# Altium schematic sheet MCU.SchDoc
size A2; SheetNumber: 1; SheetTotal: 7
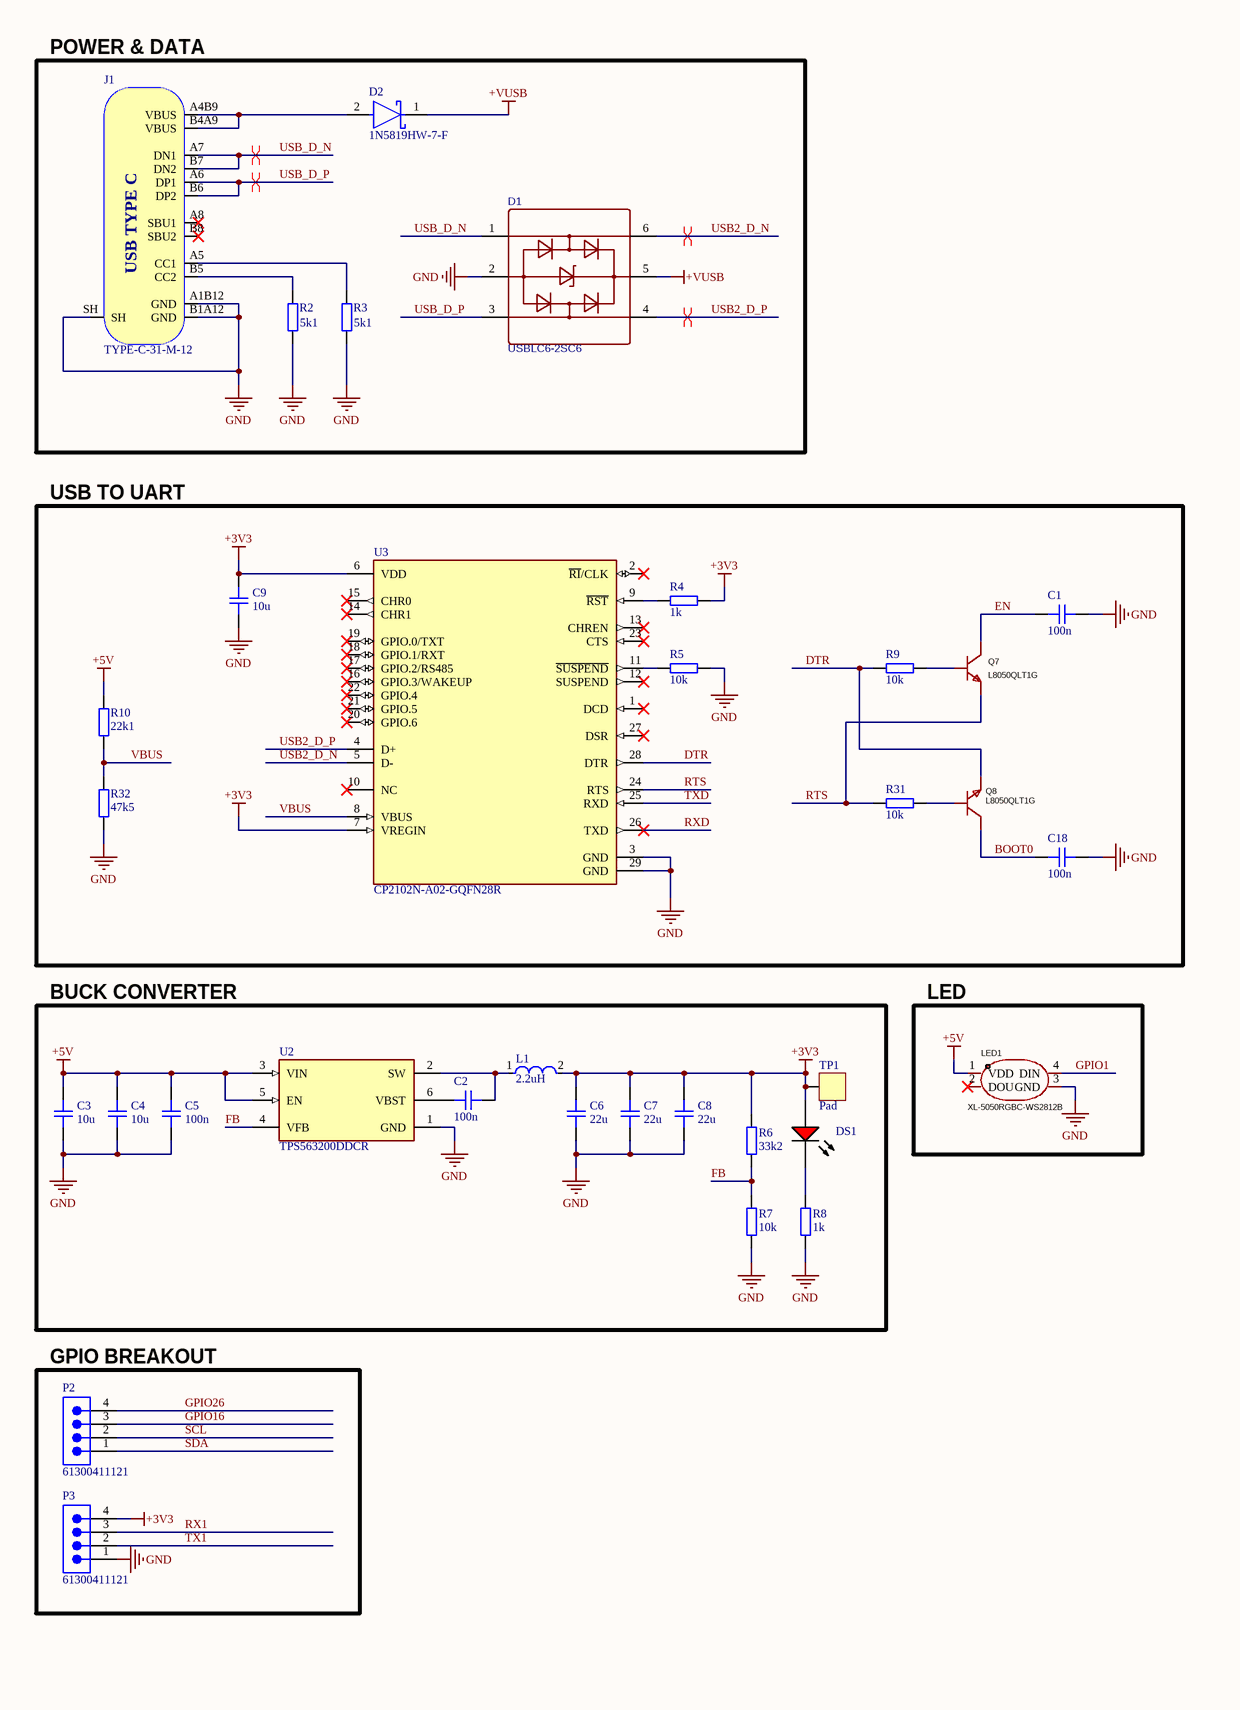
[diagram p0: MCU.SchDoc, left]
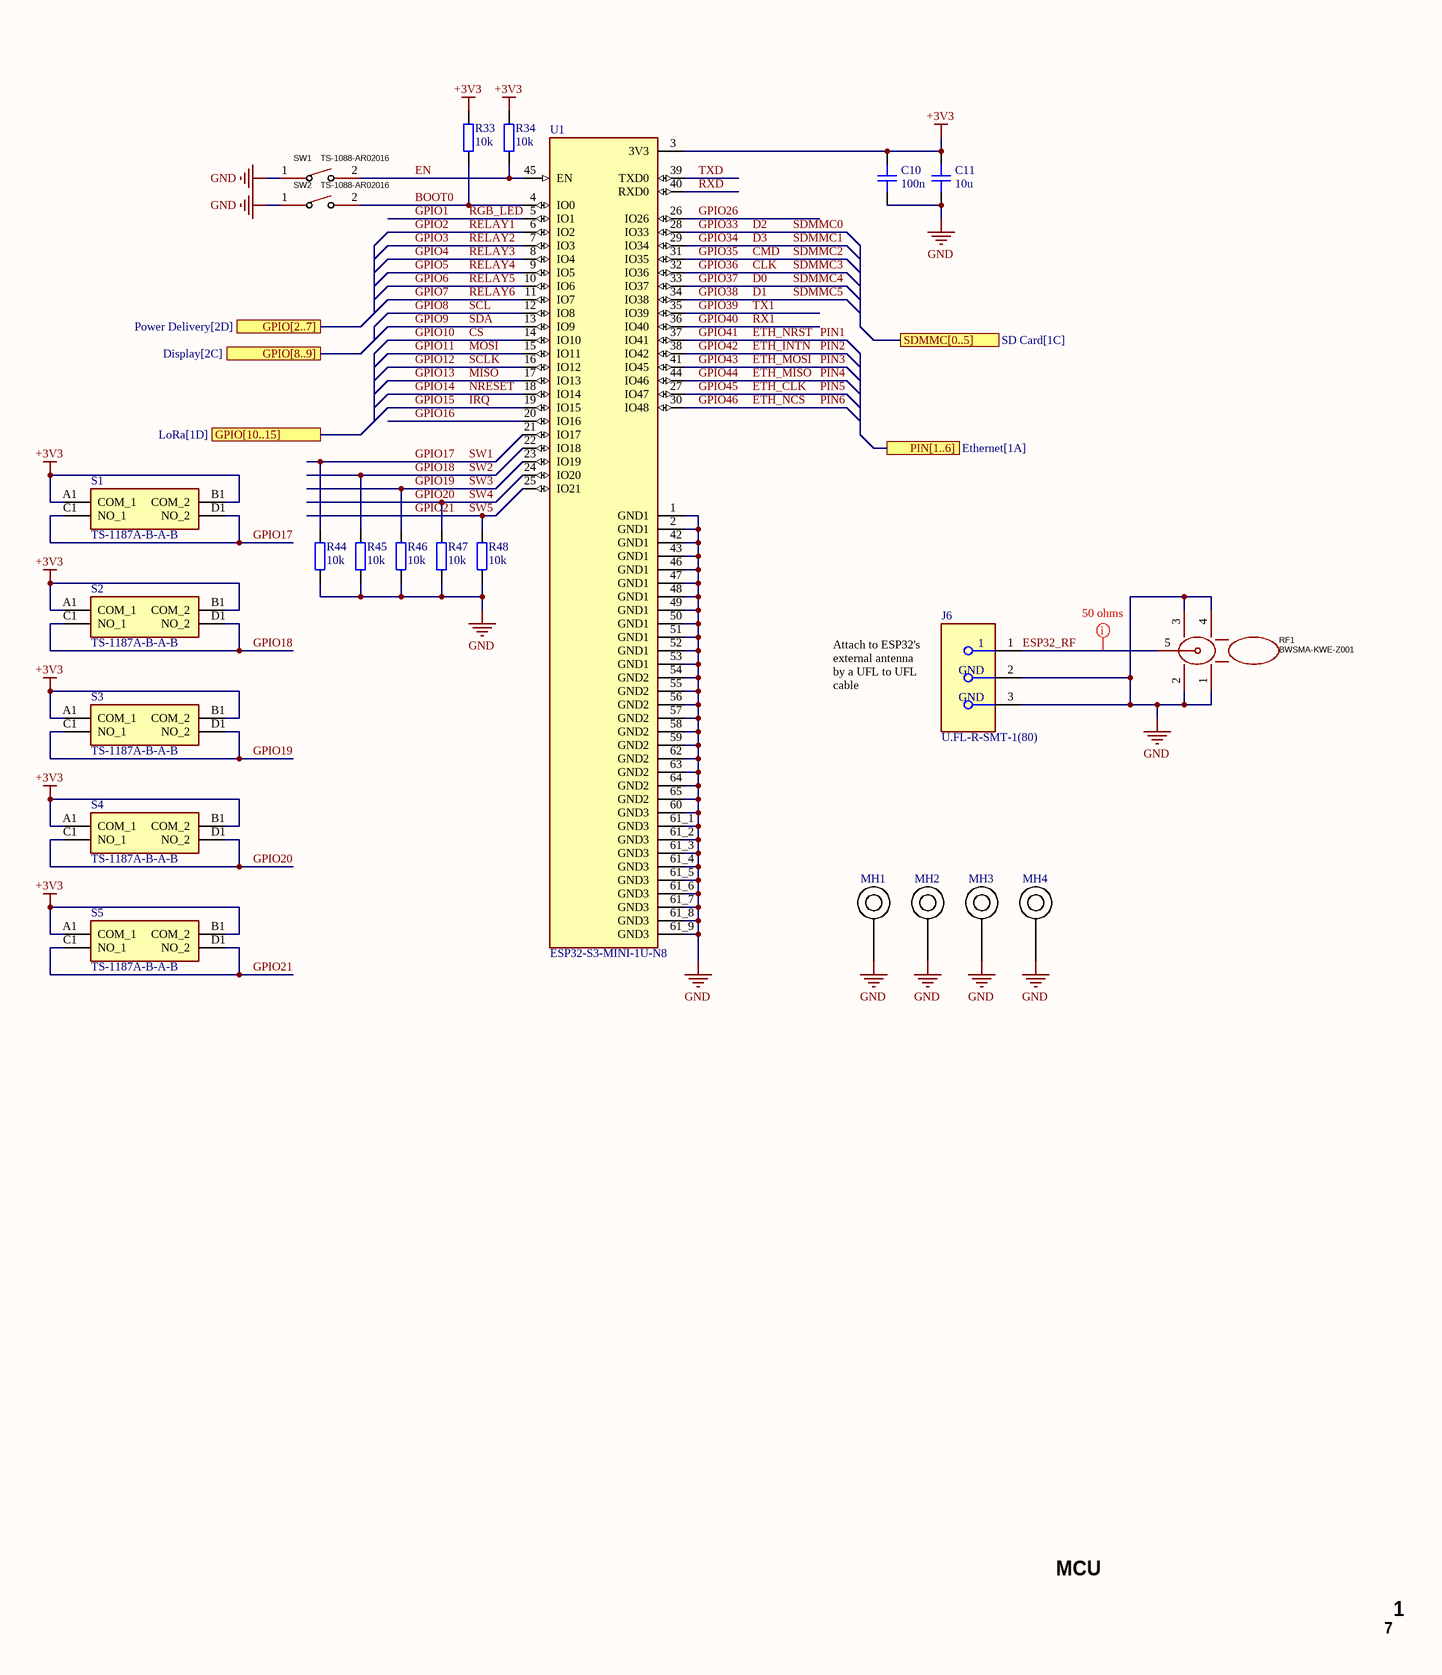
[diagram p1: MCU.SchDoc, right]

## Parts
C1  Rating: 100n  [CAP_0402]  (hidden comment: CL05B104KB54PNC)
C2  Rating: 100n  [CAP_0402]  (hidden comment: CL05B104KB54PNC)
C3  value 10u  [CAP_0402]  (hidden comment: CL05A106MQ5NUNC)
C4  value 10u  [CAP_0402]  (hidden comment: CL05A106MQ5NUNC)
C5  Rating: 100n  [CAP_0402]  (hidden comment: CL05B104KB54PNC)
C6  Rating: 22u  [CAP_0402]  (hidden comment: GRM158R61A226ME15D)
C7  Rating: 22u  [CAP_0402]  (hidden comment: GRM158R61A226ME15D)
C8  Rating: 22u  [CAP_0402]  (hidden comment: GRM158R61A226ME15D)
C9  value 10u  [CAP_0402]  (hidden comment: CL05A106MQ5NUNC)
C10  Rating: 100n  [CAP_0402]  (hidden comment: CL05B104KB54PNC)
C11  value 10u  [CAP_0402]  (hidden comment: CL05A106MQ5NUNC)
C18  Rating: 100n  [CAP_0402]  (hidden comment: CL05B104KB54PNC)
D1  USBLC6-2SC6  [SOT-23-6_L2.9-W1.6-P0.95-LS2.8-BL]
D2  1N5819HW-7-F  [FP-SOD123-IPC_A]
DS1  LTST-C170KRKT  [LTST-C170KRKT_V]  (value not drawn)
J1  TYPE-C-31-M-12  [TYPE-C-31-M-12]
J6  U.FL-R-SMT-1(80)  [FP-U_FL-R-SMT-1_80-MFG]
L1  Inductance: 2.2uH  [FP-IHLP-1212BZ-11-MFG]  (hidden comment: IHLP1212BZER2R2M11)
LED1  XL-5050RGBC-WS2812B  [LED-SMD_4P-L5.0-W5.0-BL_XL-5050RGBC]
MH1  M3PlatedMountingHole2  [PCBComponent_1 - duplicate]  (value not drawn)  (no BOM)
MH2  M3PlatedMountingHole2  [PCBComponent_1 - duplicate]  (value not drawn)  (no BOM)
MH3  M3PlatedMountingHole2  [PCBComponent_1 - duplicate]  (value not drawn)  (no BOM)
MH4  M3PlatedMountingHole2  [PCBComponent_1 - duplicate]  (value not drawn)  (no BOM)
P2  61300411121  [61300411121]
P3  61300411121  [61300411121]
Q7  L8050QLT1G  [SOT-23-3_L2.9-W1.3-P1.90-LS2.4-BR]
Q8  L8050QLT1G  [SOT-23-3_L2.9-W1.3-P1.90-LS2.4-BR]
R2  value 5k1  [RES_0402]  (hidden comment: 0402WGF5101TCE)
R3  value 5k1  [RES_0402]  (hidden comment: 0402WGF5101TCE)
R4  value 1k  [RES_0402]  (hidden comment: 0402WGF1001TCE)
R5  value 10k  [RES_0402]  (hidden comment: 0402WGF1002TCE)
R6  value 33k2  [RES_0402]  (hidden comment: 0402WGF3322TCE)
R7  value 10k  [RES_0402]  (hidden comment: 0402WGF1002TCE)
R8  value 1k  [RES_0402]  (hidden comment: 0402WGF1001TCE)
R9  value 10k  [RES_0402]  (hidden comment: 0402WGF1002TCE)
R10  Rating: 22k1  [RES_0402]  (hidden comment: 0402WGF2212TCE)
R31  value 10k  [RES_0402]  (hidden comment: 0402WGF1002TCE)
R32  Parameter 1: 47k5  [RES_0402]  (hidden comment: RC0402FR-0747K5L)
R33  value 10k  [RES_0402]  (hidden comment: 0402WGF1002TCE)
R34  value 10k  [RES_0402]  (hidden comment: 0402WGF1002TCE)
R44  value 10k  [RES_0402]  (hidden comment: 0402WGF1002TCE)
R45  value 10k  [RES_0402]  (hidden comment: 0402WGF1002TCE)
R46  value 10k  [RES_0402]  (hidden comment: 0402WGF1002TCE)
R47  value 10k  [RES_0402]  (hidden comment: 0402WGF1002TCE)
R48  value 10k  [RES_0402]  (hidden comment: 0402WGF1002TCE)
RF1  BWSMA-KWE-Z001  [SMA-TH_BWSMA-KWE-Z001]
S1  TS-1187A-B-A-B  [TS1187ABAB]
S2  TS-1187A-B-A-B  [TS1187ABAB]
S3  TS-1187A-B-A-B  [TS1187ABAB]
S4  TS-1187A-B-A-B  [TS1187ABAB]
S5  TS-1187A-B-A-B  [TS1187ABAB]
SW1  TS-1088-AR02016  [SW-SMD_L3.9-W3.0-P4.45]
SW2  TS-1088-AR02016  [SW-SMD_L3.9-W3.0-P4.45]
TP1  Pad  [PAD_SQ_2MM]  (no BOM)
U1  ESP32-S3-MINI-1U-N8  [XCVR_ESP32-S3-MINI-1U-N8]
U2  TPS563200DDCR  [FP-DDC0006A-MFG]
U3  CP2102N-A02-GQFN28R  [FP-CP2102N-A02-GQFN28R-MFG]

## Blocks framed on the sheet
POWER & DATA: D1 D2 J1 R2 R3
USB TO UART: C1 C9 C18 Q7 Q8 R4 R5 R9 R10 R31 R32 U3
BUCK CONVERTER: C2-C8 DS1 L1 R6-R8 TP1 U2
LED: LED1
GPIO BREAKOUT: P2 P3

## Ports
GPIO[2..7] (see Power Delivery[2D]), GPIO[8..9] (see Display[2C]), GPIO[10..15] (see LoRa[1D]), PIN[1..6] (see Ethernet[1A]), SDMMC[0..5] (see SD Card[1C])

## Nets
+3V3: C6.2 C7.2 C8.2 C9.2 C10.2 C11.2 DS1.1(A) L1.2 P3.4 R4.1 R6.2 R33.1 R34.1 S1.A1(COM_1) S1.B1(COM_2) S2.A1(COM_1) S2.B1(COM_2) S3.A1(COM_1) S3.B1(COM_2) S4.A1(COM_1) S4.B1(COM_2) S5.A1(COM_1) S5.B1(COM_2) TP1.1 U1.3(3V3) U3.6(VDD) U3.7(VREGIN)
+5V: C3.2 C4.2 C5.2 LED1.1(VDD) R10.2 U2.3(VIN) U2.5(EN)
+VUSB: D1.5 D2.1(C)
GND: C1.1 C3.1 C4.1 C5.1 C6.1 C7.1 C8.1 C9.1 C10.1 C11.1 C18.1 D1.2 J1.A1B12(GND) J1.B1A12(GND) J1.SH J6.2(GND) J6.3(GND) LED1.3(GND) MH1.1 MH2.1 MH3.1 MH4.1 P3.1 R2.2 R3.2 R5.1 R7.1 R8.1 R32.1 R44.2 R45.2 R46.2 R47.2 R48.2 RF1.1 RF1.2 RF1.3 RF1.4 SW1.1 SW2.1 U1.1(GND1) U1.2(GND1) U1.42(GND1) U1.43(GND1) U1.46(GND1) U1.47(GND1) U1.48(GND1) U1.49(GND1) U1.50(GND1) U1.51(GND1) U1.52(GND1) U1.53(GND1) U1.54(GND2) U1.55(GND2) U1.56(GND2) U1.57(GND2) U1.58(GND2) U1.59(GND2) U1.60(GND3) U1.61_1(GND3) U1.61_2(GND3) U1.61_3(GND3) U1.61_4(GND3) U1.61_5(GND3) U1.61_6(GND3) U1.61_7(GND3) U1.61_8(GND3) U1.61_9(GND3) U1.62(GND2) U1.63(GND2) U1.64(GND2) U1.65(GND2) U2.1(GND) U3.3(GND) U3.29(GND)
BOOT0: C18.2 Q8.3(C) R33.2 SW2.2 U1.4(IO0)
CLK: U1.32(IO36)  [also labelled GPIO36, SDMMC3]
CMD: U1.31(IO35)  [also labelled GPIO35, SDMMC2]
CS: U1.14(IO10)  [also labelled GPIO10]
D0: U1.33(IO37)  [also labelled GPIO37, SDMMC4]
D1: U1.34(IO38)  [also labelled GPIO38, SDMMC5]
D2: U1.28(IO33)  [also labelled GPIO33, SDMMC0]
D3: U1.29(IO34)  [also labelled GPIO34, SDMMC1]
DTR: Q8.2(E) R9.2 U3.28(DTR)
EN: C1.2 Q7.3(C) R34.2 SW1.2 U1.45(EN)
ESP32_RF: J6.1 RF1.5
ETH_CLK: U1.27(IO47)  [also labelled GPIO45, PIN5]
ETH_INTN: U1.38(IO42)  [also labelled GPIO42, PIN2]
ETH_MISO: U1.44(IO46)  [also labelled GPIO44, PIN4]
ETH_MOSI: U1.41(IO45)  [also labelled GPIO43, PIN3]
ETH_NCS: U1.30(IO48)  [also labelled GPIO46, PIN6]
ETH_NRST: U1.37(IO41)  [also labelled GPIO41, PIN1]
FB: R6.1 R7.2 U2.4(VFB)
GPIO1: LED1.4(DIN) U1.5(IO1)  [also labelled RGB_LED]
GPIO2: U1.6(IO2)  [also labelled RELAY1]
GPIO3: U1.7(IO3)  [also labelled RELAY2]
GPIO4: U1.8(IO4)  [also labelled RELAY3]
GPIO5: U1.9(IO5)  [also labelled RELAY4]
GPIO6: U1.10(IO6)  [also labelled RELAY5]
GPIO7: U1.11(IO7)  [also labelled RELAY6]
GPIO8: P2.2 U1.12(IO8)  [also labelled SCL]
GPIO9: P2.1 U1.13(IO9)  [also labelled SDA]
GPIO11: U1.15(IO11)  [also labelled MOSI]
GPIO12: U1.16(IO12)  [also labelled SCLK]
GPIO13: U1.17(IO13)  [also labelled MISO]
GPIO14: U1.18(IO14)  [also labelled NRESET]
GPIO15: U1.19(IO15)  [also labelled IRQ]
GPIO16: P2.3 U1.20(IO16)
GPIO17: R44.1 S1.C1(NO_1) S1.D1(NO_2) U1.21(IO17)  [also labelled SW1]
GPIO18: R45.1 S2.C1(NO_1) S2.D1(NO_2) U1.22(IO18)  [also labelled SW2]
GPIO19: R46.1 S3.C1(NO_1) S3.D1(NO_2) U1.23(IO19)  [also labelled SW3]
GPIO20: R47.1 S4.C1(NO_1) S4.D1(NO_2) U1.24(IO20)  [also labelled SW4]
GPIO21: R48.1 S5.C1(NO_1) S5.D1(NO_2) U1.25(IO21)  [also labelled SW5]
GPIO26: P2.4 U1.26(IO26)
GPIO39: P3.2 U1.35(IO39)  [also labelled TX1]
GPIO40: P3.3 U1.36(IO40)  [also labelled RX1]
RTS: Q7.2(E) R31.2 U3.24(RTS)
RXD: U1.40(RXD0) U3.26(TXD)
TXD: U1.39(TXD0) U3.25(RXD)
USB2_D_N: D1.6 U3.5(D-)
USB2_D_P: D1.4 U3.4(D+)
USB_D_N: D1.1 J1.A7(DN1) J1.B7(DN2)
USB_D_P: D1.3 J1.A6(DP1) J1.B6(DP2)
VBUS: R10.1 R32.2 U3.8(VBUS)
NetC2_1: C2.1 L1.1 U2.2(SW)
NetC2_2: C2.2 U2.6(VBST)
NetD2_2: D2.2(A) J1.A4B9(VBUS) J1.B4A9(VBUS)
NetDS1_2: DS1.2(K) R8.2
NetJ1_A5: J1.A5(CC1) R3.1
NetJ1_B5: J1.B5(CC2) R2.1
NetQ7_1: Q7.1(B) R9.1
NetQ8_1: Q8.1(B) R31.1
NetR4_2: R4.2 U3.9(~{RST})
NetR5_2: R5.2 U3.11(~{SUSPEND})

Not connected (* = marked no-connect by the designer): J1 A8(SBU1)* B8(SBU2)*; LED1 2(DOU)*; U3 1(DCD)* 2(~{RI}/CLK)* 10(NC)* 12(SUSPEND)* 13(CHREN)* 14(CHR1)* 15(CHR0)* 16(GPIO.3/WAKEUP)* 17(GPIO.2/RS485)* 18(GPIO.1/RXT)* 19(GPIO.0/TXT)* 20(GPIO.6)* 21(GPIO.5)* 22(GPIO.4)* 23(CTS)* 27(DSR)*

## Layout directives
differential pair: USB2_D_N, USB2_D_P, USB_D_N, USB_D_P
mark named 50 ohms: ESP32_RF

## Notes on the sheet
- Attach to ESP32's external antenna by a UFL to UFL cable
- MCU
- 7
- 1
- (in symbol TYPE-C-31-M-12) USB TYPE C

## Library data of the parts
C1-C11 C18 = CAP_0402: Capacitor SMD 0402; Manufacturer: *; Manufacturer Part Number: *; Distributor Link: *; LCSC: *; Dielectric: *
D1 = USBLC6-2SC6: Manufacturer: ST(意法半导体); Supplier: LCSC; Manufacturer Part: USBLC6-2SC6; Supplier Part: C7519; JLCPCB Part Class: Extended Part; spicePre: D; spiceSymbolName: USBLC6-2SC6
D2 = CMP-0303-00003-3: DIODE SCHOTTKY 40V 1A SOD123; Forward Voltage: 450mV; Capacitance: 110pF; Max Forward Surge Current (Ifsm): 25A; Peak Reverse Current: 50uA; Polarity: Standard; Element Configuration: Single; Max Power Dissipation: 450mW; Min Operating Temperature: -65°C; Package Quantity: 3000; Contact Plating: Tin; Weight: 0.000353oz; Max Repetitive Reverse Voltage (Vrrm): 40V; Max Reverse Voltage (DC): 40V; Height: 1.25mm; Average Rectified Current: 1A; Width: 1.7mm; Case/Package: SOD-123-2; Lead Free: Lead Free; Max Operating Temperature: 125°C; Current Rating: 1A; Termination: SMD/SMT; Forward Current: 1A; Radiation Hardening: No; Number of Pins: 2; Length: 2.85mm; Voltage Rating (DC): 40V; REACH SVHC: No SVHC; Peak Non-Repetitive Surge Current: 25A; Packaging: Tape and Reel; Output Current: 1A
DS1 = CMP-2000-07593-1: LED Red, 75 mW, 54 mcd, -55 to 85 degC, 2-Pin SMD, RoHS, Tape and Reel; Manufacturer: Lite-On; Lens Transparency: Clear; Number of Elements: 1; Power Rating: 75mW; Luminous Intensity: 54mcd; Viewing Angle: 130degrees; Forward Current: 30mA; Wavelength: 639nm; Lens Style: Rectangular; Case\/Package: 0805; Test Current: 20mA; Dominant Wavelength: 631nm; Forward Voltage: 2V; Lens Colour: Colorless; Min Operating Temperature: -55degC; RoHSCompliant: True; Length: 3.2mm; Width: 1.25mm; Mount: SurfaceMount; Packaging: TapeandReel; Number of LEDs: 1; Radiation Hardening: No; Datasheet URL: http://optoelectronics.liteon.com/upload/download/DS-22-99-0150/LTST-C170KRKT.pdf; Datasheet Version: Rev. D, 11/2014; Case Code (Metric): 2012; Height: 1.1mm; Number of Pins: 2; Package Description: 2-Pin Surface Mount Device, Body 2 x 1.25 mm; Manufacturer URL: http://www.us.liteon.com/; Lead Free: LeadFree; Illumination Colour: Red; Colour: Red; Case Code (Imperial): 0805; Max Operating Temperature: 85degC; Power Dissipation: 75mW; Mounting Technology: SurfaceMount; Package Reference: C170KRKT; Package Quantity: 1; Depth: 1.6mm
J1 = TYPE-C-31-M-12: USB Type C Connector Horizontal SMT; Manufacturer: Koren Hroparts; Manufacturer Part Number: TYPE-C-31-M-12
J6 = CMP-11598-000004-1: CONN U.FL RCPT STR 50 OHM SMD; Mating Cycles: 30; Impedance: 50R; Body Plating: Silver; Center Contact Plating: Gold; Body Material: Bronze; Dielectric Material: Polymer; Connector Type: Receptacle; Number of Ports: 1; Max Frequency: 6GHz; Mount: Surface Mount; Termination: Solder; Case/Package: SMD/SMT; Min Operating Temperature: -40°C; Series: U.FL; Max Operating Temperature: 90°C; Fastening Type: SNAP-ON; RoHS Compliant: Yes; Packaging: Tape and Reel; Package Quantity: 10000; Contact Material: Brass; Housing Color: Beige; Lead Free: Lead Free
L1 = CMP-02424-000689-1: FIXED IND 2.2UH 3A 46 MOHM SMD; DC Resistance (DCR): 46mR; Inductance Tolerance: 20%; Saturation Current: 3.3A; Self Resonant Frequency: 55MHz; Core Material: Metal; Shielding: Shielded; Test Frequency: 100kHz; RMS Current (Irms): 3A; Max DC Current: 3A; Contact Plating: Tin; Mount: Surface Mount; Series: IHLP-1212BZ-11; Current Rating: 3A; Height - Seated (Max): 0.079inch; Radiation Hardening: No; Package Quantity: 3000; Max Operating Temperature: 125°C; Military Standard: Not; Depth: 3.2mm; Rated Current-Max: 3A; Height: 2mm; Lead Free: Lead Free; Termination: SMD/SMT; RoHS Compliant: Yes; Tolerance: 20%; Packaging: Tape and Reel; Case/Package: 1212; Number of Pins: 2; Min Operating Temperature: -55°C; Width: 3mm; Length: 3.6mm
LED1 = XL-5050RGBC-WS2812B_1: Manufacturer: XINGLIGHT(成兴光); Add into BOM: yes; Symbol: XL-5050RGBC-WS2812B; Device: XL-5050RGBC-WS2812B; LCSC Part Name: XL-5050RGBC-WS2812B; Supplier Part: C2843785; Manufacturer Part: XL-5050RGBC-WS2812B; Supplier Footprint: SMD5050; JLCPCB Part Class: Extended Part; Datasheet: https://atta.szlcsc.com/upload/public/pdf/source/20240412/E1004CAA80592E31D08BFE019083806F.pdf; Supplier: LCSC; Convert to PCB: yes
P2 P3 = CMP-1502-01064-3: NexarPartId: 32855522; Operating Supply Voltage: 250V; Pitch: 2.54mm; Contact Resistance: 20mΩ; Number of Positions: 4; Current Rating: 3A; Connector Type: Male Pin; Gender: Male; Contact Plating: Gold; Height: 8.89mm; Lead Pitch: 2.54mm; Lead Free: Lead Free; Contact Mating Length: 5.9944mm; Number of Rows: 1; Termination: Solder; Packaging: Bulk; REACH SVHC: Unknown; Min Operating Temperature: -40°C; RoHS: Compliant; Number of Contacts: 4; Voltage Rating: 250V; Color: Black; Max Operating Temperature: 105°C; Contact Material: Copper; Mount: Through Hole; Orientation: Vertical; Number of Pins: 4
Q7 Q8 = L8050QLT1G: Manufacturer: LRC(乐山无线电); Add into BOM: yes; DC Current Gain (hFE@Ic,Vce): 100@100mA,1V; Collector Cut-Off Current (Icbo): 150nA; Collector-Emitter Saturation Voltage (VCE(sat)@Ic,Ib): 500mV@800mA,80mA; Symbol: L8050QLT1G; Device: L8050QLT1G; LCSC Part Name: NPN 电流:800mA 耐压:25V; Supplier Part: C49581; Manufacturer Part: L8050QLT1G; Supplier Footprint: SOT-23; JLCPCB Part Class: Extended Part; Datasheet: https://atta.szlcsc.com/upload/public/pdf/source/20150518/1457707314424.pdf; Supplier: LCSC; Convert to PCB: yes; Operating Temperature: -55℃~+150℃
R2 R3 = RES_0402: Resistor SMD 0402 5.1k; Manufacturer: *; Manufacturer Part Number: *; Distributor Link: *; LCSC: *
R4-R10 R31-R34 R44-R48 = RES_0402: Resistor SMD 0402; Manufacturer: *; Manufacturer Part Number: *; Distributor Link: *; LCSC: *
RF1 = BWSMA-KWE-Z001: Manufacturer: BAT WIRELESS(蝙蝠无线); Add into BOM: yes; Connector Type: Board Side; Interface: Inner Bore; Number of Ports: 1; Interface Diameter: 5.3mm; RF Series: SMA; Impedance: 50Ω; Style: Elbow; Symbol: BWSMA-KWE-Z001; Device: BWSMA-KWE-Z001; LCSC Part Name: 内孔 SMA 弯头; Supplier Part: C496551; Manufacturer Part: BWSMA-KWE-Z001; Supplier Footprint: 插件; JLCPCB Part Class: Extended Part; Datasheet: https://item.szlcsc.com/datasheet/BWSMA-KWE-Z001/508500.html; Supplier: LCSC; Convert to PCB: yes; Interface Length/Height: -; Value: -; Operating Temperature Range: -
S1-S5 = TS-1187A-B-A-B: Switch; Manufacturer_Name: XKB Connectivity; Datasheet Link: http://www.helloxkb.com/public/images/pdf/TS-1187A-X-X-X.pdf; Height: 4.05mm; Manufacturer_Part_Number: TS-1187A-B-A-B
SW1 SW2 = TS-1088-AR02016: Manufacturer: XUNPU(讯普); Add into BOM: yes; Circuit: SPST; Actuator Style: Round Button; Operating Force: 160gf; Switch Length: 4mm; Switch Width: 3mm; Switch Height: 2mm; Strike Gundam: 不带; Contact Current: 50mA; Voltage Rating (DC): 12V; Insulation Resistance: 100MΩ; Actuator/Cap Color: Black; Pin Style: SMDSplicing; Mechanical Life: 10万次; Symbol: TS-1088-AR02016; Device: TS-1088-AR02016; LCSC Part Name: 4*3*2mm 立贴 轻触开关; Supplier Part: C720477; Manufacturer Part: TS-1088-AR02016; Supplier Footprint: SMD; JLCPCB Part Class: Basic Part; Datasheet: https://atta.szlcsc.com/upload/public/pdf/source/20200810/C720475_60D09DD6C54279ADDB2DC25100F1CC11.pdf; Supplier: LCSC; Convert to PCB: yes; Mounting Style: Brick nogging; Operating Temperature: -30℃~+80℃
TP1 = PAD_SQ_2MM: Test Point Square 2mm
U1 = ESP32-S3-MINI-1U-N8: Bluetooth, WiFi 802.11b/g/n, Bluetooth v5.0 Transceiver Module 2.4GHz Antenna Not Included, U.FL Surface Mount; MF: Espressif Systems; SnapEDA_Link: https://www.snapeda.com/parts/ESP32-S3-MINI-1U-N8/Espressif+Systems/view-part/?ref=snap; Package: VFQFN-56 Espressif Systems; Value: *; MP: ESP32-S3-MINI-1U-N8; Check_prices: https://www.snapeda.com/parts/ESP32-S3-MINI-1U-N8/Espressif+Systems/view-part/?ref=eda
U2 = CMP-04918-000155-1: IC REG BUCK ADJ 3A TSOT23-6; Quiescent Current: 190uA; Output Voltage: 7V; Min Input Voltage: 4.5V; Output Configuration: Positive; Number of Outputs: 1; Switching Frequency: 650kHz; Synchronous Rectifier: Yes; Min Output Voltage: 760mV; Output Type: Adjustable; Operating Supply Voltage: 17V; Max Operating Temperature: 125°C; Lead Free: Lead Free; Packaging: Tape and Reel; Radiation Hardening: No; Mount: Surface Mount; Contact Plating: Tin; Output Current: 3A; Max Output Voltage: 7V; Min Operating Temperature: -40°C; Case/Package: SOT-23-6; Max Output Current: 3A; Max Input Voltage: 17V
U3 = CMP-08093-000007-1: IC USB TO UART BRIDGE QFN28